# EasyEDA Pro project PCB.epro

# Schematic Schematic1
Board Name: Board1; Create Date: 2026-04-07; Page Name: P1; Project Name: Qein X1A Lite S3; Schematic Name: Schematic1; Update Date: 2026-04-24; Company: EasyEDA.com; Page Size: A4; Version: V1.0
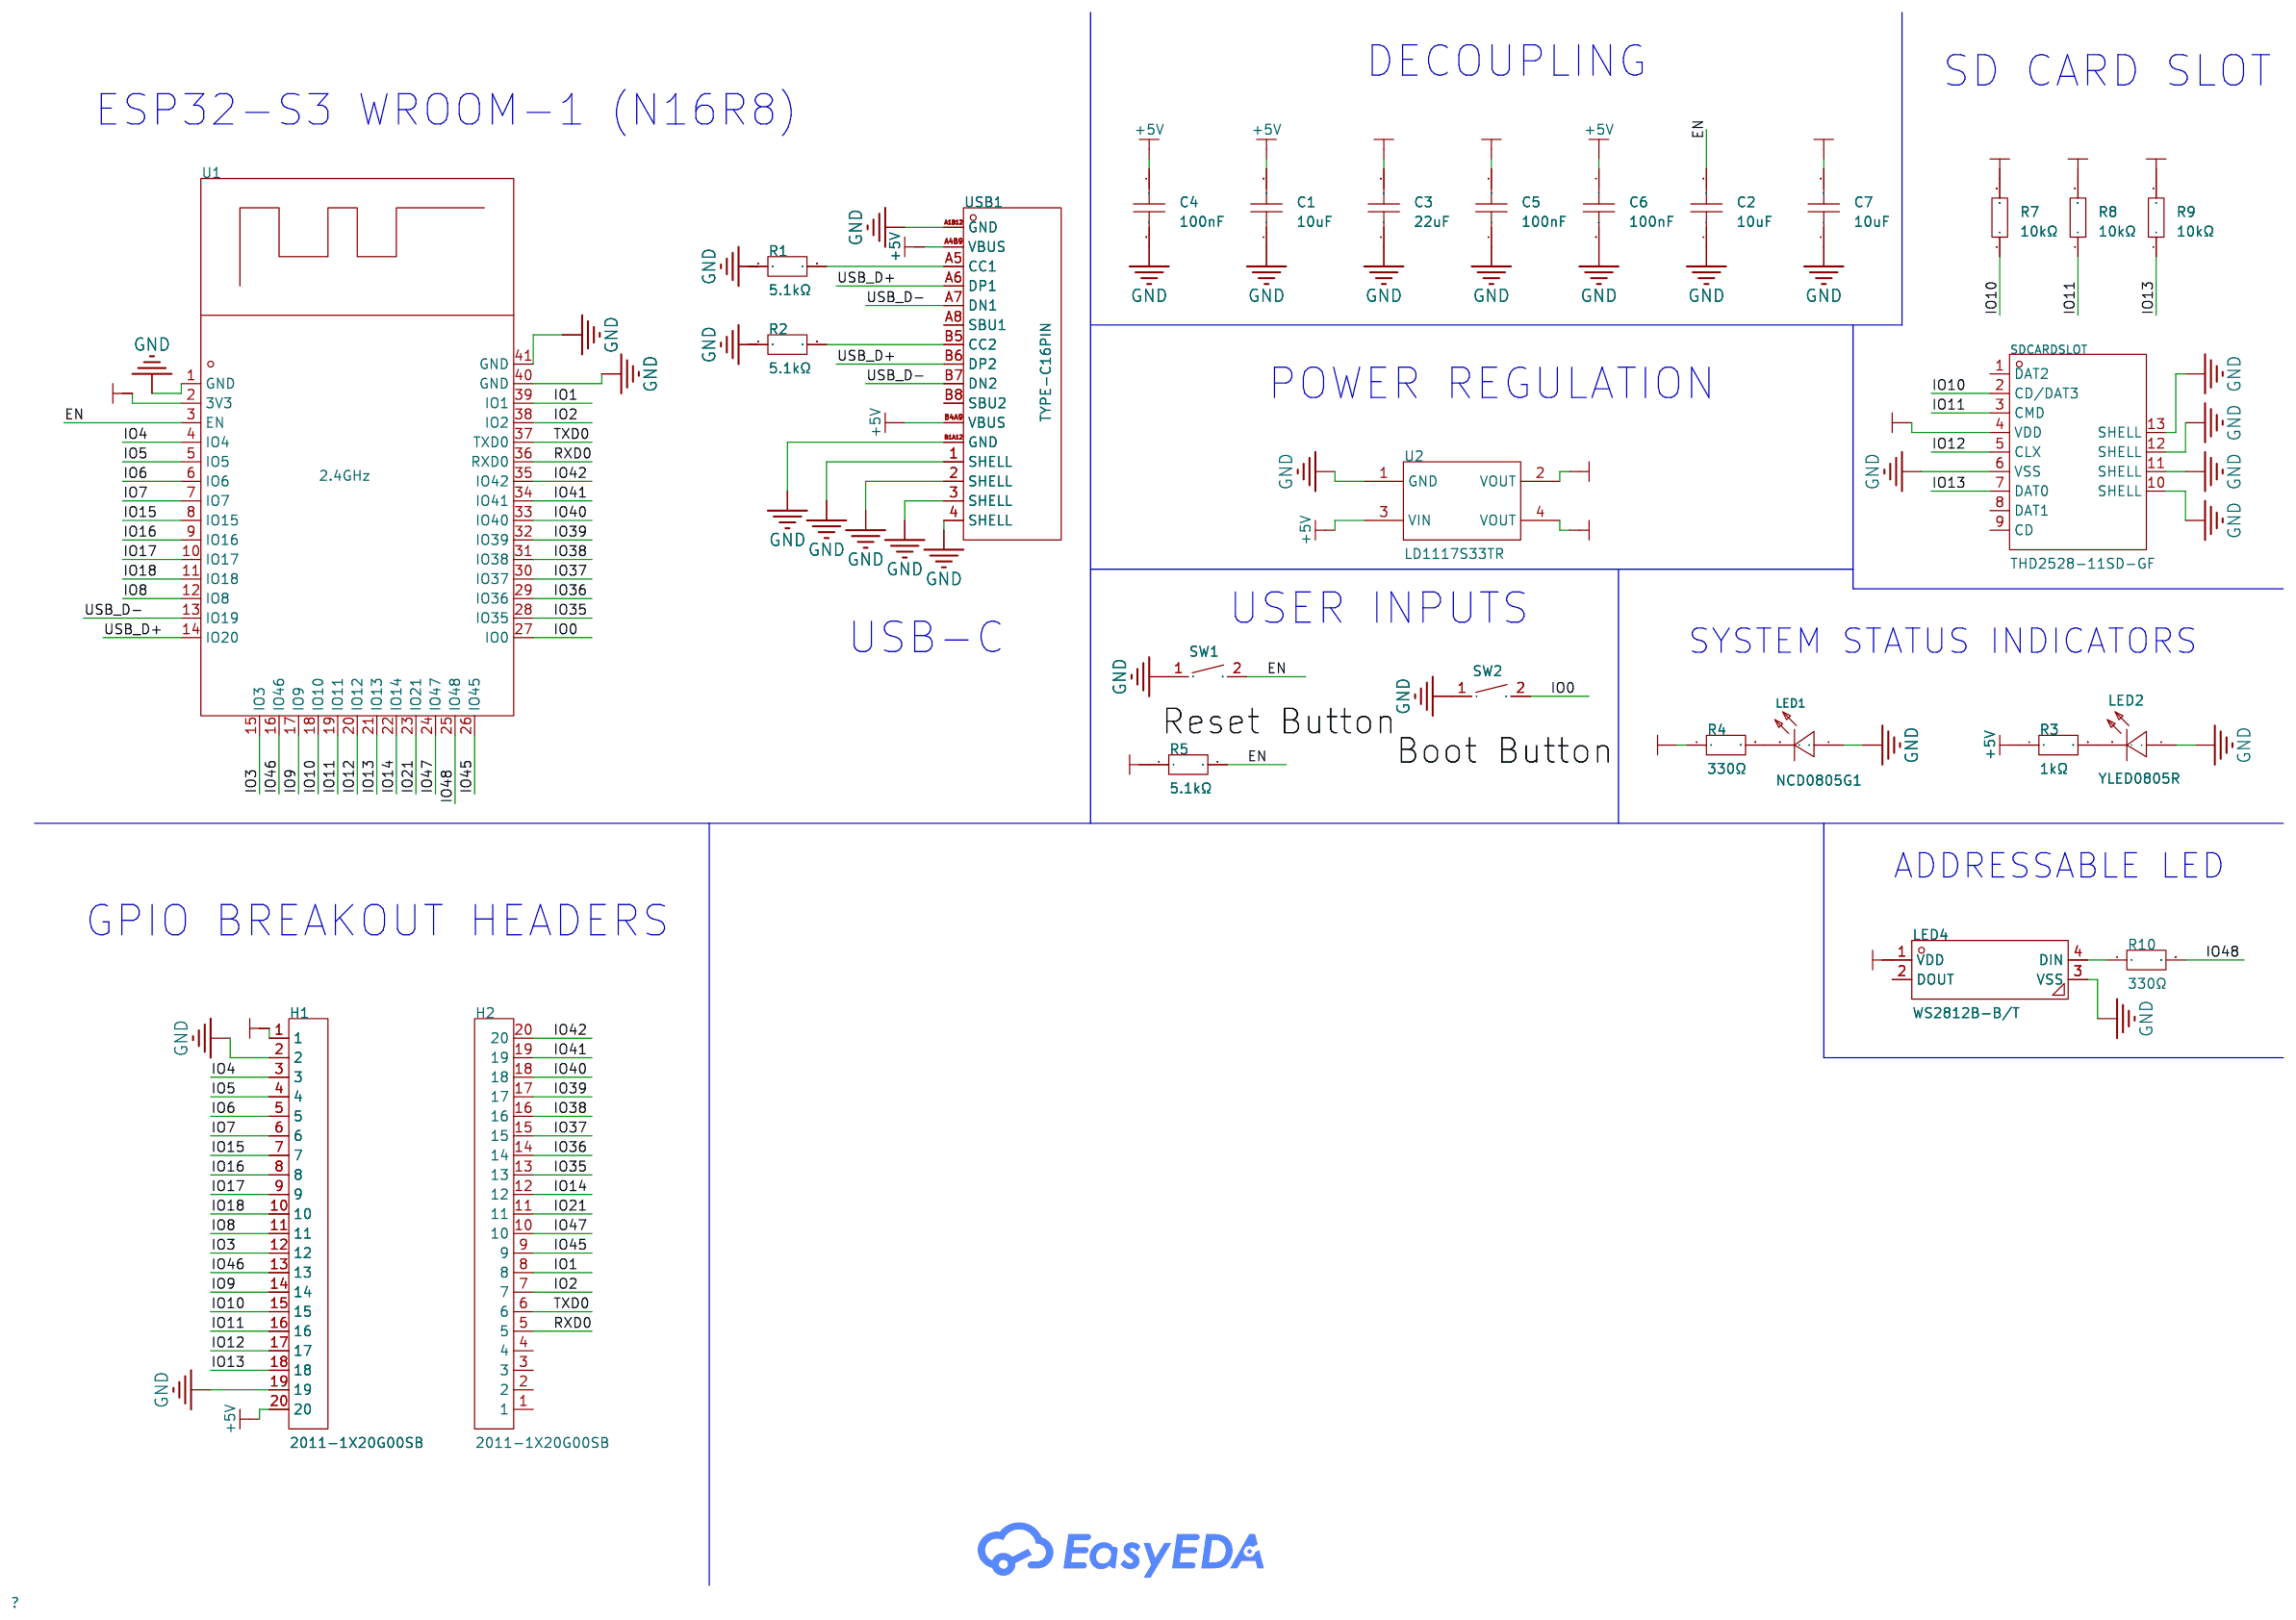
[diagram p0: schematic sheet]

## Parts
C1  10uF  [C0603]
C2  10uF  [C0603]
C3  22uF  [C0805]
C4  100nF  [C0603]
C5  100nF  [C0603]
C6  100nF  [C0603]
C7  10uF  [C0603]
H1  2011-1X20G00SB  [HDR-TH_20P-P2.54_2011-1X20G00SB]
H2  2011-1X20G00SB  [HDR-TH_20P-P2.54_2011-1X20G00SB]
LED1  NCD0805G1  [LED0805-R-RD]
LED2  YLED0805R  [LED0805-R-RD_RED]
LED4  WS2812B-B/T  [LED-SMD_4P-L5.0-W5.0-TL_WS2812B-B]
R1  5.1kΩ  [R0603]
R2  5.1kΩ  [R0603]
R3  1kΩ  [R0603]
R4  330Ω  [R0603]
R5  5.1kΩ  [R0603]
R7  10kΩ  [R0603]
R8  10kΩ  [R0603]
R9  10kΩ  [R0603]
R10  330Ω  [R0603]
SDCARDSLOT  THD2528-11SD-GF  [TF-SMD_THD2528-11SD-GF]
SW1  Reset Button  [KEY-SMD_L4.0-W3.0-LS4.9-1]
SW2  Boot Button  [KEY-SMD_L4.0-W3.0-LS4.9-1]
U1  2.4GHz  [WIRELM-SMD_ESP32-S3-WROOM-1]
U2  LD1117S33TR  [SOT-223_L6.5-W3.5-P2.30-LS7.0-BR]
USB1  TYPE-C16PIN  [USB-C-SMD_TYPE-C16PIN]

## Library data of the parts
C1 C2 C7 = CL10A106KP8NNNC: Capacitance:10uF Tolerance:±10% Tolerance:±10% Voltage Rating:10V Temperature Coefficient:X5R; LCSC Part Name: 10uF ±10% 10V; Supplier Part: C19702; Manufacturer: SAMSUNG(三星); Supplier Footprint: 0603; JLCPCB Part Class: Basic Part; Datasheet: https://item.szlcsc.com/datasheet/CL10A106KP8NNNC/20411.html; Supplier: LCSC; Tolerance: ±10%; Voltage Rating: 10V; Temperature Coefficient: X5R
C3 = CGA0805X5R226M250MT: Capacitance:22uF Tolerance:±20% Tolerance:±20% Voltage Rating:25V Temperature Coefficient:X5R; LCSC Part Name: 22uF ±20% 25V; Supplier Part: C6119899; Manufacturer: HRE(芯声); Supplier Footprint: 0805; JLCPCB Part Class: Extended Part; Datasheet: https://item.szlcsc.com/datasheet/CGA0805X5R226M250MT/7062605.html; Supplier: LCSC; Tolerance: ±20%; Voltage Rating: 25V; Temperature Coefficient: X5R
C4-C6 = CC0603KRX7R9BB104: Capacitance:100nF Tolerance:±10% Tolerance:±10% Voltage Rating:50V Temperature Coefficient:X7R; LCSC Part Name: 100nF ±10% 50V; Supplier Part: C14663; Manufacturer: YAGEO(国巨); Supplier Footprint: 0603; JLCPCB Part Class: Basic Part; Datasheet: https://item.szlcsc.com/datasheet/CC0603KRX7R9BB104/15331.html; Supplier: LCSC; Tolerance: ±10%; Voltage Rating: 50V; Temperature Coefficient: X7R
H1 H2 = 2011-1X20G00SB: Pin Structure:1x20P Pitch:2.54mm Circluar Pins/Square Pins:Pin Header Mounting Type:Through Hole Number of Rows:1 Number of Pins:20P Current Rating:3A Voltage Rating (Max):600V Length of Mating Pin:6mm Insulation Height:2.5mm Length of End Connection Pin:; LCSC Part Name: 1x20P 间距:2.54mm 方针 直插; Supplier Part: C49569643; Manufacturer: WingTAT(格林柏); Supplier Footprint: 插件,P=2.54mm; JLCPCB Part Class: Extended Part; Datasheet: https://item.szlcsc.com/datasheet/2011-1X20G00SB/52123951.html; Supplier: LCSC; Pin Structure: 1x20P; Pitch: 2.54mm; Circluar Pins/Square Pins: Pin Header; Mounting Type: Through Hole; Number of Rows: 1; Number of Pins: 20P; Current Rating: 3A; Voltage Rating (Max): 600V; Length of Mating Pin: 6mm; Insulation Height: 2.5mm; Length of End Connection Pin: 3mm; Contact Material: Brass; Contact Plating: Gold; Operating Temperature: -40℃~+105℃; Color: Black
LED1 = NCD0805G1: Lamp Holder Type:- Illumination Color:Green Voltage - Forward(Vf):2.5V~3.6V Voltage - Forward(Vf):2.5V~3.6V Power(Watts):72mW Forward Current:20mA Wavelength - Dominant:525nm~537.5nm Wavelength - Dominant:525nm~537.5nm Peak Wavelength:520nm Diode Configur; LCSC Part Name: 片式发光二极管; Supplier Part: C84260; Manufacturer: 国星光电; Supplier Footprint: 0805; JLCPCB Part Class: Extended Part; Datasheet: https://item.szlcsc.com/datasheet/NCD0805G1/85429.html; Supplier: LCSC; Illumination Color: Green; Voltage - Forward(Vf): 2.5V~3.6V; Power(Watts): 72mW; Forward Current: 20mA; Wavelength - Dominant: 525nm~537.5nm; Peak Wavelength: 520nm; Diode Configuration: Discrete Diode; Luminous Intensity: 400mcd; Viewing Angle: 130°; Operating Temperature: -30℃~+85℃
LED2 = YLED0805R: Emitted Color:Red Forward Voltage (VF):1.8V~2.4V Forward Voltage (VF):1.8V~2.4V Power Dissipation:60mW Forward Current:20mA Dominant Wavelength:615nm~630nm Dominant Wavelength:615nm~630nm Peak Wavelength:645nm Diode Configuration:- Lens Color:- Color Temp; Supplier Part: C19171391; Manufacturer: YONGYUTAI(永裕泰); Supplier Footprint: 0805; JLCPCB Part Class: Extended Part; Datasheet: https://atta.szlcsc.com/upload/public/pdf/source/20231027/AB486D22E6D71BC59190C48A798367E6.pdf; Supplier: LCSC; Emitted Color: Red; Forward Voltage (VF): 1.8V~2.4V; Power Dissipation: 60mW; Forward Current: 20mA; Dominant Wavelength: 615nm~630nm; Peak Wavelength: 645nm; Operating Temperature: -40℃~+85℃
LED4 = WS2812B-B/T: Wavelength:520nm；471nm；621nm Luminous Intensity:R:300mcd~500mcd；B:200mcd~300mcd；G:600mcd~1000mcd Fixed-Frequency Pwm Mode:2kHz Data Transmission Rate:800Kbit/s Voltage - Supply:- Voltage - Supply:- Quiescent Current:0.6mA Lens Color:- Peak Wavelength:G:52; LCSC Part Name: RGB三色; Supplier Part: C2761795; Manufacturer: worldsemi; Supplier Footprint: SMD5050-4P; JLCPCB Part Class: Extended Part; Datasheet: https://item.szlcsc.com/datasheet/WS2812B-B%252FT/2886707.html; Supplier: LCSC; Wavelength: 520nm；471nm；621nm; Luminous Intensity: R:300mcd~500mcd；B:200mcd~300mcd；G:600mcd~1000mcd; Fixed-Frequency Pwm Mode: 2kHz; Data Transmission Rate: 800Kbit/s; Quiescent Current: 0.6mA; Peak Wavelength: G:520nm；R:621nm；B:471nm; Length: 5mm; Width: 1.57mm; Height: 5.4mm
R1 R2 R5 = FRC0603F5101TS: Type:Thick Film Resistor Resistance:5.1kΩ Tolerance:±1% Tolerance:±1% Power(Watts):100mW Voltage-Supply(Max):75V Temperature Coefficient:±100ppm/℃ Temperature Coefficient:±100ppm/℃ Operating Temperature:-55℃~+155℃ Operating Temperature:-55℃~+155℃; LCSC Part Name: 5.1kΩ ±1% 100mW 厚膜电阻; Supplier Part: C2907044; Manufacturer: FOJAN(富捷); Supplier Footprint: 0603; JLCPCB Part Class: Extended Part; Supplier: LCSC; Type: Thick Film Resistor; Tolerance: ±1%; Power(Watts): 100mW; Voltage-Supply(Max): 75V; Temperature Coefficient: ±100ppm/℃; Operating Temperature: -55℃~+155℃
R3 = FRC0603J102 TS: Type:Thick Film Resistor Resistance:1kΩ Tolerance:±5% Tolerance:±5% Power(Watts):100mW Voltage-Supply(Max):75V Temperature Coefficient:±100ppm/℃ Temperature Coefficient:±100ppm/℃ Operating Temperature:-55℃~+155℃ Operating Temperature:-55℃~+155℃; LCSC Part Name: 1kΩ ±5% 100mW 厚膜电阻; Supplier Part: C2907113; Manufacturer: FOJAN(富捷); Supplier Footprint: 0603; JLCPCB Part Class: Extended Part; Supplier: LCSC; Type: Thick Film Resistor; Tolerance: ±5%; Power(Watts): 100mW; Voltage-Supply(Max): 75V; Temperature Coefficient: ±100ppm/℃; Operating Temperature: -55℃~+155℃
R4 R10 = FRC0603J331 TS: Type:Thick Film Resistor Resistance:330Ω Tolerance:±5% Tolerance:±5% Power(Watts):100mW Voltage-Supply(Max):75V Temperature Coefficient:±100ppm/℃ Temperature Coefficient:±100ppm/℃ Operating Temperature:-55℃~+155℃ Operating Temperature:-55℃~+155℃; LCSC Part Name: 330Ω ±5% 100mW 厚膜电阻; Supplier Part: C2907152; Manufacturer: FOJAN(富捷); Supplier Footprint: 0603; JLCPCB Part Class: Extended Part; Supplier: LCSC; Type: Thick Film Resistor; Tolerance: ±5%; Power(Watts): 100mW; Voltage-Supply(Max): 75V; Temperature Coefficient: ±100ppm/℃; Operating Temperature: -55℃~+155℃
R7-R9 = RC0603FR-0710KL: Type:Thick Film Resistors Resistance: Tolerance:±1% Tolerance:±1% Power(Watts): Overload Voltage (Max): Temperature Coefficient:±100ppm/℃ Temperature Coefficient:±100ppm/℃ Operating Temperature Range:-55℃~+155℃ Operating Temperature Range:-55℃~+155℃; LCSC Part Name: 厚膜电阻 10kΩ ±1% 100mW; Supplier Part: C98220; Manufacturer: YAGEO(国巨); Supplier Footprint: 0603; JLCPCB Part Class: Extended Part; Datasheet: https://atta.szlcsc.com/upload/public/pdf/source/20180927/C295883_E8D83085EA81BD7DE0B2B681138C15EE.pdf; Supplier: LCSC; Type: Thick Film Resistors; Tolerance: ±1%; Temperature Coefficient: ±100ppm/℃; Operating Temperature Range: -55℃~+155℃
SDCARDSLOT = THD2528-11SD-GF: Card Connection Mode:Push-Push Card Type:MicroSD Card (TF Card) Connector Type:Connector and Ejector Additional Card Detection Pins:No Height Above Board:2mm Operating Temperature:- Operating Temperature:-; LCSC Part Name: 自弹式 MicroSD卡(TF卡) 卡座; Supplier Part: C283232; Manufacturer: THD(台华达); Supplier Footprint: SMD; JLCPCB Part Class: Extended Part; Datasheet: https://item.szlcsc.com/datasheet/THD2528-11SD-GF/268992.html; Supplier: LCSC; Card Connection Mode: Push-Push; Card Type: MicroSD Card (TF Card); Connector Type: Connector and Ejector; Additional Card Detection Pins: No; Height Above Board: 2mm
SW1 SW2 = HX 3x4x2-2P-1.6N TACTILE SWITCH: Circuit:SPST Actuator Style:Round Button Operating Force:1.6N Mounting Type:Surface Mount,Vertical Length:4mm Width:3mm Switch Height:2mm with Bracket:Without Bracket Contact Current:50mA Voltage Rating:12V Actuator/Cap Color:Black With Lamp:No IP Rating:; LCSC Part Name: 4*3*2mm 立贴 轻触开关; Supplier Part: C49234124; Manufacturer: hanxia(韩下); Supplier Footprint: SMD; JLCPCB Part Class: Extended Part; Datasheet: https://item.szlcsc.com/datasheet/HX%25203x4x2-2P-1.6N%2520TACTILE%2520SWITCH/51650185.html; Supplier: LCSC; Circuit: SPST; Actuator Style: Round Button; Operating Force: 1.6N; Mounting Type: Surface Mount,Vertical; Length: 4mm; Width: 3mm; Switch Height: 2mm; with Bracket: Without Bracket; Contact Current: 50mA; Voltage Rating: 12V; Actuator/Cap Color: Black; With Lamp: No; Termination Style: SMD(SMT) Tab; Life: 100,000 Cycles
U1 = ESP32-S3-WROOM-1-N16: Utilized IC / Part:ESP32-S3 Wireless Standard:Bluetooth5.0 Interface Type:I2C；GPIO；UART；SPI；USB；I2S Frequency:2.4GHz Antenna Type:On-board PCB Antenna Output Power:20.5dBm Output Power:20.5dBm Voltage - Supply:3V~3.6V Voltage - Supply:3V~3.6V Receive  Cur; LCSC Part Name: 不带固件 通用型Wi-Fi+低功耗蓝牙MCU模组; Supplier Part: C2913199; Manufacturer: ESPRESSIF(乐鑫); Supplier Footprint: SMD,25.5x18mm; JLCPCB Part Class: Extended Part; Datasheet: https://item.szlcsc.com/datasheet/ESP32-S3-WROOM-1-N16/3198297.html; Supplier: LCSC; Utilized IC / Part: ESP32-S3; Wireless Standard: Bluetooth5.0; Interface Type: I2C；GPIO；UART；SPI；USB；I2S; Antenna Type: On-board PCB Antenna; Output Power: 20.5dBm; Voltage - Supply: 3V~3.6V; Receive  Current: 95mA; Send  Current: 355mA; Sensitivity: -103.5dBm; Operating Temperature: -40℃~+85℃
U2 = LD1117S33TR: Output Type:Fixed Maximum Input Voltage:15V Output Voltage:3.3V Output Voltage:3.3V Output Current:800mA Power Supply Rejection Ratio (PSRR):75dB@(120Hz) Dropout Voltage:1.2V@(800mA) standby current:10mA Feature:Thermal Protection(TSD)；Overcurrent Protect; LCSC Part Name: 可调与固定低压降正电压稳压器; Supplier Part: C86781; Manufacturer: ST(意法半导体); Supplier Footprint: SOT-223; JLCPCB Part Class: Extended Part; Datasheet: https://atta.szlcsc.com/upload/public/pdf/source/20181022/C283467_00098992BB1D287195B66486CE33A2DD.pdf; Supplier: LCSC; Output Type: Fixed; Maximum Input Voltage: 15V; Output Voltage: 3.3V; Output Current: 800mA; Power Supply Rejection Ratio (PSRR): 75dB@(120Hz); Dropout Voltage: 1.2V@(800mA); standby current: 10mA; Feature: Thermal Protection(TSD)；Overcurrent Protection(OCP); Operating Temperature: 0℃~+125℃; Output Polarity: Positive electrode; Number of Outputs: 1
USB1 = TYPE-C16PIN: Connector Type:Type-C Protocol Standard:- Gender:Female Mounting Type:Surface Mount, Right Angle Number of Contacts:16P Number of Ports:1 Current Rating-Power:3A Voltage Rating:30V Connect-Disconnect Life:10,000 Cycles Supplementary Features:- Center Heig; LCSC Part Name: 16P卧贴母座; Supplier Part: C393939; Manufacturer: SHOU HAN(首韩); Supplier Footprint: SMD; JLCPCB Part Class: Extended Part; Datasheet: https://item.szlcsc.com/datasheet/TYPE-C16PIN/372551.html; Supplier: LCSC; Connector Type: Type-C; Gender: Female; Mounting Type: Surface Mount, Right Angle; Number of Contacts: 16P; Number of Ports: 1; Current Rating-Power: 3A; Voltage Rating: 30V; Connect-Disconnect Life: 10,000 Cycles; Detection color: Black; Operating Temperature: -40℃~+85℃

## Nets
+3V3: C3.2 C5.2 C7.2 H1.1 LED4.1(VDD) R4.1 R5.1 R7.2 R8.2 R9.2 SDCARDSLOT.4(VDD) U1.2(3V3) U2.2(VOUT) U2.4(VOUT)
+5V: C1.2 C4.1 C6.1 H1.20 R3.1 U2.3(VIN) USB1.A4B9(VBUS) USB1.B4A9(VBUS)
GND: C1.1 C2.1 C3.1 C4.2 C5.1 C6.2 C7.1 H1.2 H1.19 LED1.1(A) LED2.1(+) LED4.3(VSS) R1.1 R2.1 SDCARDSLOT.6(VSS) SDCARDSLOT.10(SHELL) SDCARDSLOT.11(SHELL) SDCARDSLOT.12(SHELL) SDCARDSLOT.13(SHELL) SW1.1 SW2.1 U1.1(GND) U1.40(GND) U1.41(GND) U2.1(GND) USB1.1(SHELL) USB1.2(SHELL) USB1.3(SHELL) USB1.4(SHELL) USB1.A1B12(GND) USB1.B1A12(GND)
EN: C2.2 R5.2 SW1.2 U1.3(EN)
IO0: SW2.2 U1.27(IO0)
IO1: H2.8 U1.39(IO1)
IO2: H2.7 U1.38(IO2)
IO3: H1.12 U1.15(IO3)
IO4: H1.3 U1.4(IO4)
IO5: H1.4 U1.5(IO5)
IO6: H1.5 U1.6(IO6)
IO7: H1.6 U1.7(IO7)
IO8: H1.11 U1.12(IO8)
IO9: H1.14 U1.17(IO9)
IO10: H1.15 R7.1 SDCARDSLOT.2(CD/DAT3) U1.18(IO10)
IO11: H1.16 R8.1 SDCARDSLOT.3(CMD) U1.19(IO11)
IO12: H1.17 SDCARDSLOT.5(CLX) U1.20(IO12)
IO13: H1.18 R9.1 SDCARDSLOT.7(DAT0) U1.21(IO13)
IO14: H2.12 U1.22(IO14)
IO15: H1.7 U1.8(IO15)
IO16: H1.8 U1.9(IO16)
IO17: H1.9 U1.10(IO17)
IO18: H1.10 U1.11(IO18)
IO21: H2.11 U1.23(IO21)
IO35: H2.13 U1.28(IO35)
IO36: H2.14 U1.29(IO36)
IO37: H2.15 U1.30(IO37)
IO38: H2.16 U1.31(IO38)
IO39: H2.17 U1.32(IO39)
IO40: H2.18 U1.33(IO40)
IO41: H2.19 U1.34(IO41)
IO42: H2.20 U1.35(IO42)
IO45: H2.9 U1.26(IO45)
IO46: H1.13 U1.16(IO46)
IO47: H2.10 U1.24(IO47)
IO48: R10.2 U1.25(IO48)
RXD0: H2.5 U1.36(RXD0)
TXD0: H2.6 U1.37(TXD0)
USB_D+: U1.14(IO20) USB1.A6(DP1) USB1.B6(DP2)
USB_D-: U1.13(IO19) USB1.A7(DN1) USB1.B7(DN2)
$1N2799: R1.2 USB1.A5(CC1)
$1N2855: R2.2 USB1.B5(CC2)
$1N3906: LED4.4(DIN) R10.1
$1N7331: LED2.2(-) R3.2
$1N7410: LED1.2(K) R4.2

Not connected (* = marked no-connect by the designer): H2 1 2 3 4; LED4 2(DOUT); SDCARDSLOT 1(DAT2) 8(DAT1) 9(CD); USB1 A8(SBU1) B8(SBU2)

## Notes on the sheet
- DECOUPLING
- SD CARD SLOT
- ESP32-S3 WROOM-1 (N16R8)
- POWER REGULATION
- USER INPUTS
- USB-C
- SYSTEM STATUS INDICATORS
- ADDRESSABLE LED
- GPIO BREAKOUT HEADERS

# Board PCB1
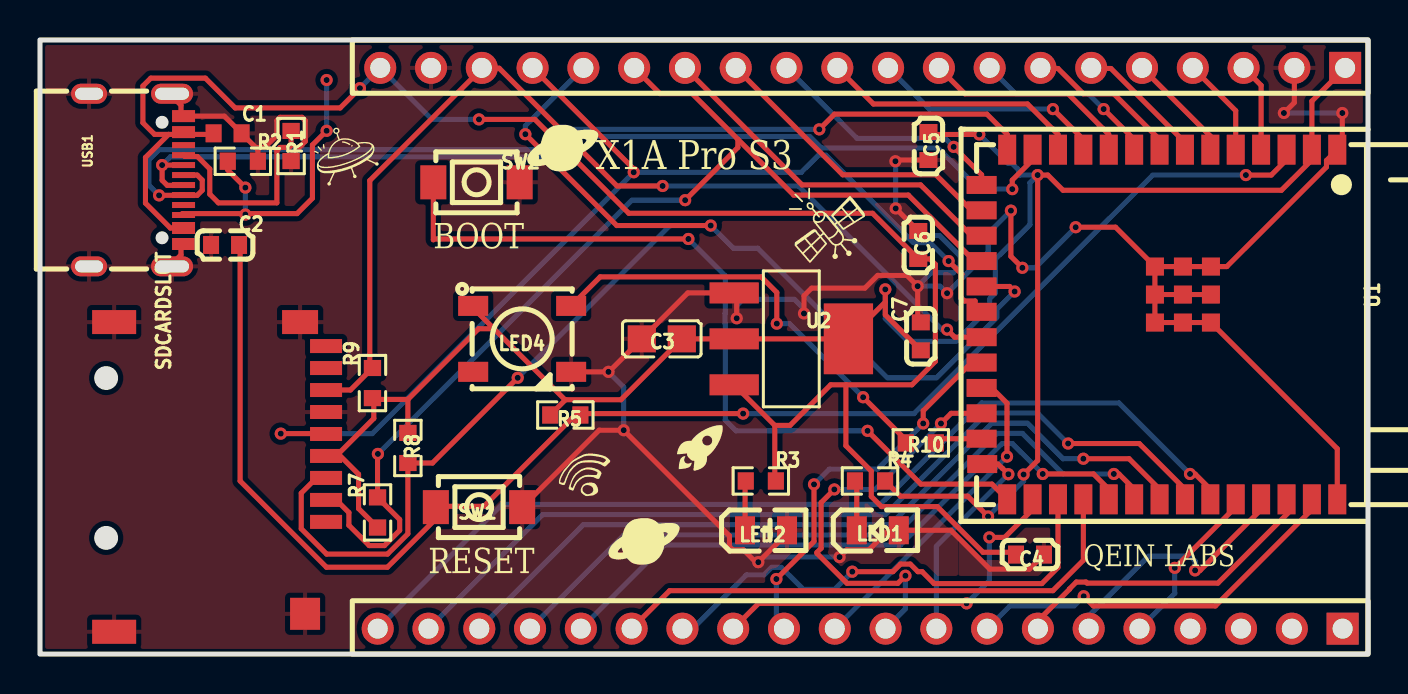
[diagram p1: board, top side]
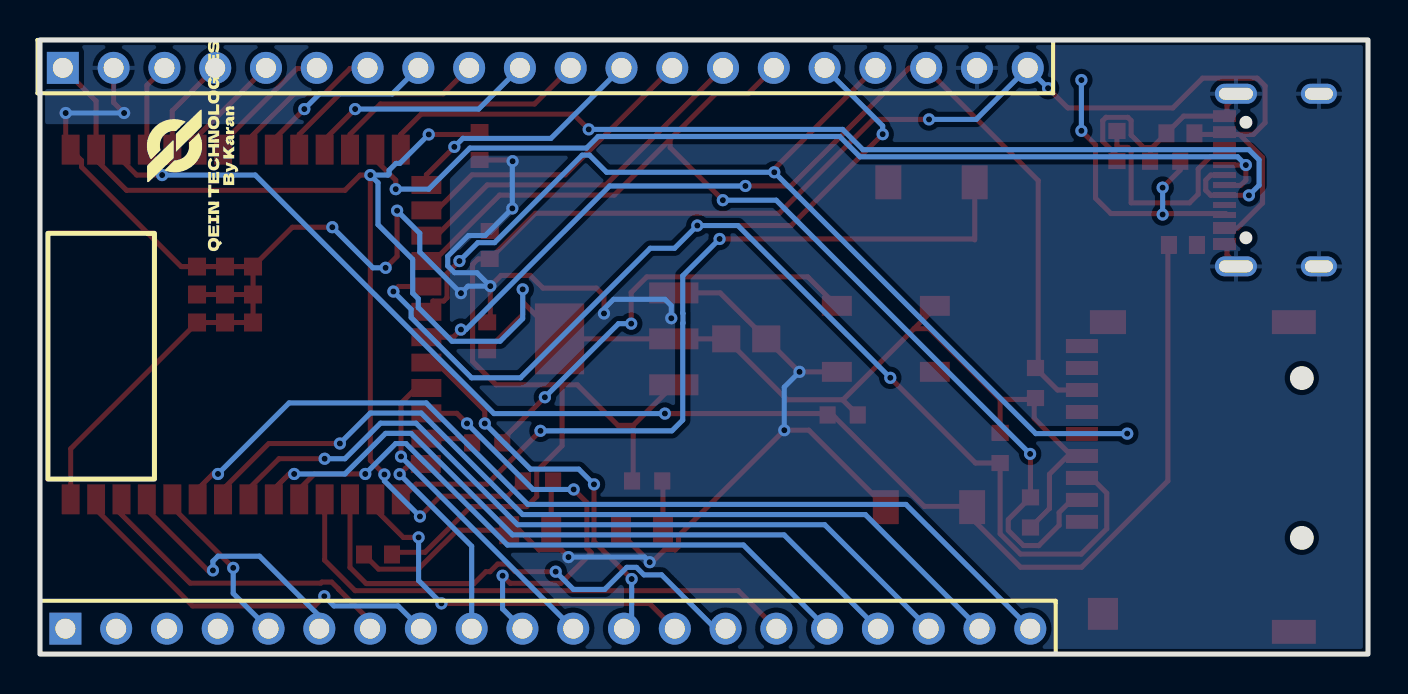
[diagram p2: board, bottom side, seen from below]

Outline 66.42 x 30.73 mm; copper layers: Top Layer, Bottom Layer. Coordinates in mm from the lower left corner of the outline.
Outline path: rectangle 0,0 66.42,30.73
Stack: Top Layer 0.035mm / Dielectric1 1.51mm FR4 er 4.5 / Bottom Layer 0.035mm

## Design rules (mm)
template: JLCPCB Capability(Two Layers Board)
spacing copperThickness1oz (default): track to track 0.102, other pairs 0.152 to 0.3
spacing copperThickness2oz: track to track 0.203, other pairs 0.152 to 0.3
track width copperThickness1oz (default): min 0.127, default 0.254, max 2.54
track width copperThickness2oz: min 0.203, default 0.254, max 2.54
differential pair differentialPair (default): width min 0.127, default 0.254, max 2.54; gap min 0.152, default 0.152
via viaSize (default): diameter min 0.5, default 0.61, max 10; hole min 0.3, default 0.305, max 6.3

## Placement (name value [footprint] x y rotation side)
C1  10uF  [C0603]  9.38 26.06 180 top
C2  10uF  [C0603]  9.26 20.47 0 top
C3  22uF  [C0805]  31.1 15.77 0 top
C4  100nF  [C0603]  49.51 4.98 0 top
C5  100nF  [C0603]  44.44 25.43 90 top
C6  100nF  [C0603]  43.93 20.47 90 top
C7  10uF  [C0603]  44.05 15.9 270 top
H1  2011-1X20G00SB  [HDR-TH_20P-P2.54_2011-1X20G00SB]  41.15 29.34 180 bottom
H2  2011-1X20G00SB  [HDR-TH_20P-P2.54_2011-1X20G00SB]  41.02 1.27 180 bottom
LED1  NCD0805G1  [LED0805-R-RD]  41.9 6.2 0 top
LED2  YLED0805R  [LED0805-R-RD_RED]  36.31 6.2 0 top
LED4  WS2812B-B/T  [LED-SMD_4P-L5.0-W5.0-TL_WS2812B-B]  24.12 15.77 0 top
R1  5.1kΩ  [R0603]  12.56 25.43 90 top
R2  5.1kΩ  [R0603]  10.14 24.66 180 top
R3  1kΩ  [R0603]  36.05 8.66 180 top
R4  330Ω  [R0603]  41.51 8.66 180 top
R5  5.1kΩ  [R0603]  26.27 11.96 0 top
R7  10kΩ  [R0603]  16.88 7.09 270 top
R8  10kΩ  [R0603]  18.4 10.31 90 top
R9  10kΩ  [R0603]  16.63 13.56 270 top
R10  330Ω  [R0603]  44.05 10.57 0 top
SDCARDSLOT  THD2528-11SD-GF  [TF-SMD_THD2528-11SD-GF]  9.01 8.86 270 top
SW1  Reset Button  [KEY-SMD_L4.0-W3.0-LS4.9-1]  21.96 7.35 180 top
SW2  Boot Button  [KEY-SMD_L4.0-W3.0-LS4.9-1]  21.83 23.61 180 top
U1  2.4GHz  [WIRELM-SMD_ESP32-S3-WROOM-1]  55.99 16.49 270 top
U2  LD1117S33TR  [SOT-223_L6.5-W3.5-P2.30-LS7.0-BR]  37.58 15.77 180 top
USB1  TYPE-C16PIN  [USB-C-SMD_TYPE-C16PIN]  4.82 23.72 270 top

## Footprints (pads in the part's own frame, mm; a bottom-side part is the same pattern mirrored in y, then rotated)
C0603
  rect 0.8x0.9 smd: 1(-0.7,0) 2(0.7,0)
C0805
  rect 1.41x1.35 smd: 1(-1,0) 2(1,0)
HDR-TH_20P-P2.54_2011-1X20G00SB
  rect 1.6x1.6 hole 1: 1(-24.13,0)
  round 1.6 hole 1: 2(-21.59,0) 3(-19.05,0) 4(-16.51,0) 5(-13.97,0) 6(-11.43,0) 7(-8.89,0) 8(-6.35,0) 9(-3.81,0) 10(-1.27,0) 11(1.27,0) 12(3.81,0) 13(6.35,0) 14(8.89,0) 15(11.43,0) 16(13.97,0) 17(16.51,0) 18(19.05,0) 19(21.59,0) 20(24.13,0)
KEY-SMD_L4.0-W3.0-LS4.9-1
  rect 1.3x1.7 smd: 1(-2.159,0) 2(2.159,0)
LED0805-R-RD
  rect 1x1.399 smd: 1(1.05,0) 2(-1.05,0)
LED0805-R-RD_RED
  rect 1x1.399 smd: 1(1.05,0) 2(-1.05,0)
LED-SMD_4P-L5.0-W5.0-TL_WS2812B-B
  rect 1.5x1 smd: 1(-2.45,1.65) 2(-2.45,-1.65) 3(2.45,-1.65) 4(2.45,1.65)
R0603
  rect 0.806x0.864 smd: 1(-0.753,0) 2(0.753,0)
SOT-223_L6.5-W3.5-P2.30-LS7.0-BR
  rect 2.465x1.05 smd: 1(2.857,-2.3) 2(2.857,0) 3(2.857,2.3)
  rect 2.465x3.54 smd: 4(-2.857,0)
TF-SMD_THD2528-11SD-GF
  rect 0.7x1.6 smd: 1(2.25,5.3) 2(1.15,5.3) 3(0.05,5.3) 4(-1.05,5.3) 5(-2.15,5.3) 6(-3.25,5.3) 7(-4.35,5.3) 8(-5.45,5.3) 9(-6.55,5.3)
  rect 1.2x1.8 smd: 10(-7.75,4)
  rect 1.2x2.2 smd: 11(-7.75,-5.3) 12(7.75,-5.3)
  rect 1.6x1.5 smd: 13(6.85,4.25)
USB-C-SMD_TYPE-C16PIN
  oval 1x2.1 hole 0.6x1.7: 1(-4.32,1.788) 2(4.32,1.788)
  oval 1x1.8 hole 0.6x1.4: 3(-4.32,-2.362) 4(4.32,-2.362)
  rect 0.6x1.15 smd: A1B12(-3.2,2.362) A4B9(-2.4,2.362) B1A12(3.2,2.362) B4A9(2.4,2.362)
  rect 0.3x1.15 smd: A5(-1.25,2.362) A6(-0.25,2.362) A7(0.25,2.362) A8(1.25,2.362) B5(1.75,2.362) B6(0.75,2.362) B7(-0.75,2.362) B8(-1.75,2.362)
WIRELM-SMD_ESP32-S3-WROOM-1
  rect 1.5x0.9 smd: 1(-8.75,8.895) 2(-8.75,7.625) 3(-8.75,6.355) 4(-8.75,5.085) 5(-8.75,3.815) 6(-8.75,2.545) 7(-8.75,1.275) 8(-8.75,0.005) 9(-8.75,-1.265) 10(-8.75,-2.535) 11(-8.75,-3.805) 12(-8.75,-5.075) 13(-8.75,-6.345) 14(-8.75,-7.615) 27(8.75,-7.615) 28(8.75,-6.345) 29(8.75,-5.075) 30(8.75,-3.805) 31(8.75,-2.535) 32(8.75,-1.265) 33(8.75,0.005) 34(8.75,1.275) 35(8.75,2.545) 36(8.75,3.815) 37(8.75,5.085) 38(8.75,6.355) 39(8.75,7.625) 40(8.75,8.895)
  rect 0.9x1.5 smd: 15(-6.985,-8.895) 16(-5.715,-8.895) 17(-4.445,-8.895) 18(-3.175,-8.895) 19(-1.905,-8.895) 20(-0.635,-8.895) 21(0.635,-8.895) 22(1.905,-8.895) 23(3.175,-8.895) 24(4.445,-8.895) 25(5.715,-8.895) 26(6.985,-8.865)
  rect 0.9x0.9 smd: 41(-2.9,2.575) 41(-2.9,1.175) 41(-2.9,-0.225) 41(-1.5,2.575) 41(-1.5,1.175) 41(-1.5,-0.225) 41(-0.1,2.575) 41(-0.1,1.175) 41(-0.1,-0.225)

## Nets
As in the schematic.

Pads without a net: H2 1 2 3 4; LED4 2; SDCARDSLOT 1 8 9; USB1 A8 B8

## Via types
v1: diameter 0.61, hole 0.305, Top Layer to Bottom Layer, 69 vias

## Routing (per net, layer and track width the routed paths; a pad name or vN(x,y) marks a point on that pad's centre or on a via; arc(x,y) is an arc through that point)
+3V3: length 113.3
  Top Layer w0.254: 42.28,17.62 42.28,16.98 C7.2 ; 42.28,17.62 v1(42.28,18.25) ; 42.28,17.62 U2.4 U2.2 C3.2 29.05,12.73 26.28,12.73 ; 18.4,12.74 16.7,12.74 ; 18.4,12.74 R8.2 ; 18.4,12.74 21.94,16.28 22.7,16.28 ; 16.7,12.74 R9.2 ; 16.7,12.74 16.7,11.79 14.92,10.01 ; 22.7,16.28 26.26,12.73 26.28,12.73 ; 22.7,16.28 21.66,17.32 LED4.1 ; 26.28,12.73 R5.1 ; R4.1 43.03,7.9 46.4,7.9 v1(47.42,6.88) ; 14.92,10.01 15.93,9 15.93,7.28 R7.2 ; 14.92,10.01 14.41,10.01 SDCARDSLOT.4 ; H1.1 63.61,27.67 U1.2 63.61,24.73 62.09,23.21 51.17,23.21 50.41,23.97 v1(49.9,23.97) 49.9,9.69 v1(49.2,8.99) ; C5.2 44.56,26 v1(46.98,26)
  Bottom Layer w0.254: v1(46.98,26) 48.43,24.56 48.62,24.56 48.96,24.21 48.96,24.02 49.01,23.97 v1(49.9,23.97) 49.51,23.59 49.51,21.49 47.78,19.76 47.78,18.06 47.5,17.78 47.5,17.34 45.81,15.65 43.41,15.65 42.28,16.79 v1(42.28,18.25) ; v1(49.2,8.99) 49.2,8.66 v1(47.42,6.88)
+5V: length 91.6
  Top Layer w0.254: 6.43,26.01 5.28,24.85 5.28,22.57 6.52,21.32 7.05,21.32 ; 6.43,26.01 8.63,26.01 C1.2 ; 6.43,26.01 5.73,26.01 5.15,26.59 5.15,28.43 5.54,28.82 8.27,28.82 9.76,27.33 15.01,27.33 v1(16,28.32) ; 36.75,11.44 37.51,11.44 39.55,13.47 40.31,13.47 ; 36.75,11.44 U2.3 ; 36.75,11.44 36.75,8.72 R3.1 ; v1(21.96,26.76) 24.75,26.76 29.45,22.06 41.64,22.06 C6.1 44.51,19.77 44.78,19.5 44.78,14.65 43.61,13.47 40.31,13.47 ; 40.31,13.47 40.31,10.43 41.58,9.16 41.58,7.89 42.09,7.38 44.88,7.38 47.17,5.09 48.7,5.09 C4.1
  Bottom Layer w0.254: v1(16,28.32) H1.20 19.6,26.76 v1(21.96,26.76)
GND: length 146.7
  Top Layer w0.254: C7.1 43.9,16.76 v1(43.9,18.41) 43.36,18.95 41.9,18.95 41.26,18.31 38.59,18.31 38.21,17.93 v1(38.21,17.04) ; LED2.1 37.36,6.04 v1(35.93,4.6) 35.8,4.6 35.18,5.22 34.65,5.22 34.48,5.38 34.48,5.91 v1(29.19,11.2) 27.97,11.2 SW1.1 ; H1.2 62.74,27.6 v1(62.22,27.08) ; U1.41 U1.41 U1.41 ; U1.41 U1.41 U1.41 U1.41 64.88,10.27 U1.40 ; U1.41 U1.41 ; 10.79,25.35 10.9,25.25 R2.1 ; 10.79,25.35 11.22,25.35 11.85,25.97 11.85,26.7 12.01,26.86 13.11,26.86 13.27,26.7 13.27,25.66 12.56,24.95 R1.1 ; 10.79,25.35 C1.1 9.22,26.92 7.05,26.92 7.05,27.47 6.48,28.04 ; v1(48.56,22.19) 48.56,19.9 v1(49.13,19.33) ; v1(51.8,21.36) 53.79,21.36 U1.41 ; v1(39.99,4.85) 40.36,5.22 41.47,5.22 42.45,6.2 LED1.1 45.56,6.2 47.5,4.25 49.49,4.25 C4.2 ; v1(42.78,24.66) 42.85,24.73 C5.1 ; v1(65.14,27.08) 65.14,25.49 U1.1 64.34,24.7 64.34,24.38 59.36,19.39 U1.41 U1.41 U1.41 ; C6.2 v1(42.8,22.3) ; 6.48,19.4 7.05,19.98 7.05,20.52 ; LED4.3 v1(28.43,14.12) 28.45,14.12 C3.1 32.4,18.07 U2.1 34.85,17.95 v1(34.85,16.8)
  Bottom Layer w0.254: v1(35.93,4.6) 36.18,4.85 v1(39.99,4.85) ; v1(38.21,17.04) 38.21,17.27 37.73,17.75 35.16,17.75 34.85,17.44 v1(34.85,16.8) ; v1(51.8,21.36) 49.77,19.33 v1(49.13,19.33) ; v1(42.78,24.66) 42.8,24.65 v1(42.8,22.3) 44.16,20.95 44.99,20.95 46.03,19.91 46.03,19.43 45.69,19.08 44.57,19.08 v1(43.9,18.41) 45.02,18.41 v1(45.37,18.06) 47.43,20.12 47.43,21.05 v1(48.56,22.19) ; v1(62.22,27.08) v1(65.14,27.08) ; v1(29.19,11.2) 29.19,13.36 v1(28.43,14.12)
EN: length 75.3
  Top Layer w0.254: C2.2 10.01,20.42 10.01,8.66 14.33,4.34 17.38,4.34 19.92,6.88 19.92,7.39 ; U1.3 62.34,24.73 61.58,23.97 v1(60.31,23.97) ; 19.92,7.39 19.84,7.39 SW1.2 ; 19.92,7.39 22.2,7.39 26.77,11.96 R5.2 27.1,12.03 v1(35.17,12.03)
  Bottom Layer w0.254: v1(60.31,23.97) 55.65,23.97 43.72,12.03 v1(35.17,12.03)
IO0: length 41.2
  Top Layer w0.254: SW2.2 19.67,20.73 19.71,20.77 v1(32.43,20.77) ; v1(41.39,11.17) 44.06,8.5 47.61,8.5 U1.27
  Bottom Layer w0.254: v1(32.43,20.77) 34.28,18.93 34.28,17.06 34.26,17.05 34.26,16.56 34.28,16.55 34.28,11.71 34.81,11.17 v1(41.39,11.17)
IO1: length 19.6
  Top Layer w0.254: U1.39 63.61,7.23 58.79,2.41 52.69,2.41 v1(52.2,2.89)
  Bottom Layer w0.254: v1(52.2,2.89) 51.72,2.41 48.51,2.41 H2.8
IO2: length 16
  Top Layer w0.254: H2.7 50.11,1.47 50.11,1.86 51.49,3.24 51.49,3.26 51.83,3.6 52.32,3.6 52.37,3.55 58.91,3.55 62.55,7.18 62.55,7.54 U1.38
IO3: length 12.5
  Top Layer w0.254: v1(45.7,25.38) 47.09,23.99 U1.15
  Bottom Layer w0.254: H1.12 40.87,25.81 45.27,25.81 v1(45.7,25.38)
IO4: length 4.5
  Top Layer w0.254: H1.3 61.07,28.46 U1.4
IO5: length 5
  Top Layer w0.254: U1.5 59.8,27.19 H1.4
IO6: length 5.5
  Top Layer w0.254: H1.5 58.53,25.92 U1.6
IO7: length 6.6
  Top Layer w0.254: U1.7 57.26,25.6 53.56,29.31 52.61,29.31 H1.6
IO8: length 13.2
  Top Layer w0.254: U1.12 50.91,26 49.39,27.53 41.69,27.53 H1.11
IO9: length 18.3
  Top Layer w0.254: H1.14 38.12,23.48 44.05,23.48 46.59,20.94 U1.17
IO10: length 55.8
  Top Layer w0.254: v1(32.27,22.72) 34.9,25.35 34.9,25.76 ; 34.9,25.76 32.62,28.05 31.01,28.05 H1.15 ; 34.9,25.76 37.7,22.97 43.43,22.97 46.73,19.67 U1.18 ; v1(16.9,10.02) 16.88,10 R7.1 17.99,6.73 17.99,6.19 17.23,5.43 16.47,5.43 15.45,6.44 15.45,7.08 14.82,7.71 SDCARDSLOT.2
  Bottom Layer w0.254: v1(32.27,22.72) 29.6,22.72 v1(16.9,10.02)
IO11: length 71.1
  Top Layer w0.254: v1(33.55,21.45) 28.85,21.45 v1(24.27,26.02) ; v1(23.89,13.83) 19.63,9.56 R8.1 18.4,6.02 17.38,5 14.34,5 13.07,6.27 13.07,8.05 13.83,8.81 SDCARDSLOT.3 ; U1.19 48.49,18.4 v1(48.75,18.14)
  Bottom Layer w0.254: v1(24.27,26.02) 24.27,26.43 H1.16 ; v1(23.89,13.83) 31.51,21.45 v1(33.55,21.45) 34.68,20.31 35.9,20.31 42.38,13.83 44.84,13.83 47.86,16.85 47.86,17.25 v1(48.75,18.14)
IO12: length 54.7
  Top Layer w0.254: SDCARDSLOT.5 14.29,11.03 v1(12.04,11.03) ; v1(45.44,19.67) 46.11,19 46.07,18.96 46.07,17.83 46.23,17.67 46.77,17.67 46.77,17.13 U1.20 ; H1.17 29.7,24.28 v1(29.7,24.11)
  Bottom Layer w0.254: v1(12.04,11.03) 16.62,11.03 v1(29.7,24.11) 38.08,24.11 38.94,24.97 39.31,24.97 43.69,20.59 44.52,20.59 v1(45.44,19.67)
IO13: length 50.7
  Top Layer w0.254: v1(31.14,23.43) 28.86,23.43 22.97,29.32 22.12,29.32 ; v1(45.37,16.24) 45.75,15.86 U1.21 ; SDCARDSLOT.7 15.53,13.21 R9.1 16.5,14.45 16.5,23.7 22.12,29.32 ; 22.12,29.32 H1.18
  Bottom Layer w0.254: v1(45.37,16.24) 45.12,16.24 37.93,23.43 v1(31.14,23.43)
IO14: length 19.4
  Top Layer w0.254: U1.22 46.59,14.59 44.17,12.17 v1(44.17,11.54) ; v1(38.71,8.49) 38.71,5.64 v1(36.83,3.75)
  Bottom Layer w0.254: v1(38.71,8.49) 39.47,9.25 41.89,9.25 v1(44.17,11.54) ; H2.12 36.83,1.65 v1(36.83,3.75)
IO15: length 8
  Top Layer w0.254: U1.8 55.99,25.75 53.71,28.04 52.18,28.04 50.91,29.31 50.07,29.31 H1.7
IO16: length 9.2
  Top Layer w0.254: v1(53.2,27.27) 54.72,25.75 U1.9
  Bottom Layer w0.254: H1.8 48.8,28.04 52.44,28.04 v1(53.2,27.27)
IO17: length 10.6
  Top Layer w0.254: H1.9 46.26,28.04 51.42,28.04 53.45,26 U1.10
IO18: length 11.8
  Top Layer w0.254: v1(50.66,27.27) 52.18,25.75 U1.11
  Bottom Layer w0.254: v1(50.66,27.27) 44.48,27.27 H1.10
IO21: length 16.4
  Top Layer w0.254: U1.23 47.6,13.32 48.37,12.56 v1(48.37,9.88)
  Bottom Layer w0.254: v1(48.37,9.88) H2.11
IO35: length 19.2
  Top Layer w0.254: v1(47.49,5.84) 48.25,5.84 49.64,7.23 U1.28 ; v1(46.34,2.54) 35.94,2.54 H2.13
  Bottom Layer w0.254: v1(47.49,5.84) 47.49,3.68 v1(46.34,2.54)
IO36: length 25.2
  Top Layer w0.254: U1.29 50.91,4.33 50.11,3.53 44.72,3.53 44.12,4.12 43.91,4.12 43.53,4.5 43.04,4.5 42.66,4.12 v1(40.63,4.12)
  Bottom Layer w0.254: H2.14 32.64,1.27 35.33,3.96 36.21,3.96 36.59,4.34 37.07,4.34 38.18,3.23 39.74,3.23 v1(40.63,4.12)
IO37: length 27.1
  Top Layer w0.254: U1.30 52.18,4.69 50.66,3.17 31.49,3.17 H2.15
IO38: length 31.7
  Top Layer w0.254: U1.31 53.45,8.25 52.69,9.01 v1(50.15,9.01)
  Bottom Layer w0.254: v1(50.15,9.01) 48.63,10.54 48.12,10.54 43.04,5.46 31.24,5.46 H2.16
IO39: length 35.9
  Top Layer w0.254: U1.32 54.72,8.25 53.96,9.01 v1(53.71,9.01)
  Bottom Layer w0.254: v1(53.71,9.01) 51.17,9.01 49.14,11.04 47.87,11.04 42.79,5.96 29.21,5.96 H2.17
IO40: length 40.2
  Top Layer w0.254: U1.33 55.99,8.25 54.47,9.77 v1(52.18,9.77)
  Bottom Layer w0.254: H2.18 27.17,6.47 42.53,6.47 47.61,11.55 49.39,11.55 51.17,9.77 v1(52.18,9.77)
IO41: length 44.4
  Top Layer w0.254: v1(51.42,10.54) 54.98,10.54 57.26,8.25 U1.34
  Bottom Layer w0.254: v1(51.42,10.54) 49.9,12.06 47.36,12.06 42.28,6.98 25.14,6.98 H2.19
IO42: length 48.6
  Top Layer w0.254: U1.35 58.53,8.25 57.77,9.01 v1(57.52,9.01)
  Bottom Layer w0.254: H2.20 23.11,7.49 42.02,7.49 47.1,12.57 53.96,12.57 v1(57.52,9.01)
IO45: length 10.7
  Top Layer w0.254: 47.12,9.51 47.91,9.51 48.12,9.3 48.13,9.3 v1(48.43,9)
  Bottom Layer w0.254: v1(48.43,9) 44.83,5.4 H2.9
IO46: length 15.3
  Top Layer w0.254: U1.16 46.59,22.21 44.81,23.99 40.15,23.99 H1.13
IO47: length 20.8
  Top Layer w0.254: v1(43.28,3.92) 42.9,3.54 40.36,3.54 38.86,5.04 38.86,5.09 39.07,5.3 39.07,7.58 v1(39.73,8.24) ; v1(45.06,11.54) 45.57,12.05 U1.24
  Bottom Layer w0.254: v1(39.73,8.24) 41.76,8.24 v1(45.06,11.54) ; H2.10 43.28,2.26 v1(43.28,3.92)
IO48: length 2.4
  Top Layer w0.254: U1.25 45.02,10.78 R10.2
RXD0: length 8.5
  Top Layer w0.254: v1(56.76,4.31) 59.8,7.36 U1.36
  Bottom Layer w0.254: v1(56.76,4.31) 56.76,3.04 H2.5
TXD0: length 12.8
  Top Layer w0.254: U1.37 61.07,7.23 58.03,4.19 v1(57.77,4.19)
  Bottom Layer w0.254: v1(57.77,4.19) 57.77,4.64 57.52,4.9 55.44,4.9 52.45,1.91 H2.6
USB_D+: length 51.2
  Top Layer w0.254: U1.14 48.37,26 47.36,27.02 39.74,27.02 v1(38.98,26.26) ; 7.23,22.96 7.05,22.97 ; 7.23,22.96 v1(5.96,22.96) ; 7.23,22.96 7.86,22.96 8.12,23.21 8.12,23.72 7.86,23.97 7.05,23.97
  Bottom Layer w0.254: v1(5.96,22.96) 5.45,23.46 5.45,24.73 5.96,25.24 25.26,25.24 26.28,26.26 v1(38.98,26.26)
USB_D-: length 49.4
  Top Layer w0.254: 7.05,24.47 v1(6.11,24.47) 6.11,23.71 6.36,23.46 7.04,23.46 7.05,23.47 ; U1.13 49.64,24.73 48.63,23.72 v1(48.63,23.27)
  Bottom Layer w0.254: v1(6.11,24.47) 6.52,24.89 25.41,24.89 26.42,25.9 38.51,25.9 39.09,25.32 44.92,25.32 46.97,23.27 v1(48.63,23.27)
$1N2799: length 10.6
  Top Layer w0.254: R1.2 12.56,25.45 12.46,25.36 12.01,25.36 11.85,25.19 11.85,22.58 8.93,22.58 8.49,23.01 8.49,24.28 7.87,24.9 7.25,24.9 USB1.A5
$1N2855: length 16.2
  Top Layer w0.254: v1(10.27,23.34) 9.39,24.22 R2.2 ; v1(14.34,26.19) 13.63,25.48 13.63,22.81 12.86,22.04 7.12,22.04 7.05,21.97
  Bottom Layer w0.254: v1(10.27,23.34) v1(10.27,22) ; v1(14.34,26.19) v1(14.34,28.73)
$1N3906: length 21.8
  Top Layer w0.254: LED4.4 28.02,18.88 36.07,18.88 36.85,18.09 v1(36.85,16.54) ; R10.1 43.3,10.72 v1(41.17,12.85)
  Bottom Layer w0.254: v1(41.17,12.85) 37.49,16.54 v1(36.85,16.54)
$1N7331: length 2.5
  Top Layer w0.254: R3.2 35.26,8.63 35.26,6.2
$1N7410: length 2.5
  Top Layer w0.254: R4.2 40.85,8.57 40.85,6.2

## Copper pours and planes (outline as drawn; the poured copper is in the pictures)
GND on Top Layer: 0,30.95 45.92,30.95 45.92,0 0,0
GND on Top Layer: 45.93,6.33 66.42,6.33 66.42,0 45.93,0
GND on Top Layer: 21.87,30.73 66.42,30.73 66.42,26.55 21.87,26.55
GND on Bottom Layer: 21.93,30.73 66.42,30.73 66.42,26.52 21.93,26.52
GND on Bottom Layer: 45.95,6.31 66.42,6.31 66.42,0 45.95,0
GND on Bottom Layer: 0,30.95 45.92,30.95 45.92,0 0,0

## Text on the board
Top Silkscreen Layer: RESET | BOOT | QEIN LABS | X1A Pro S3
